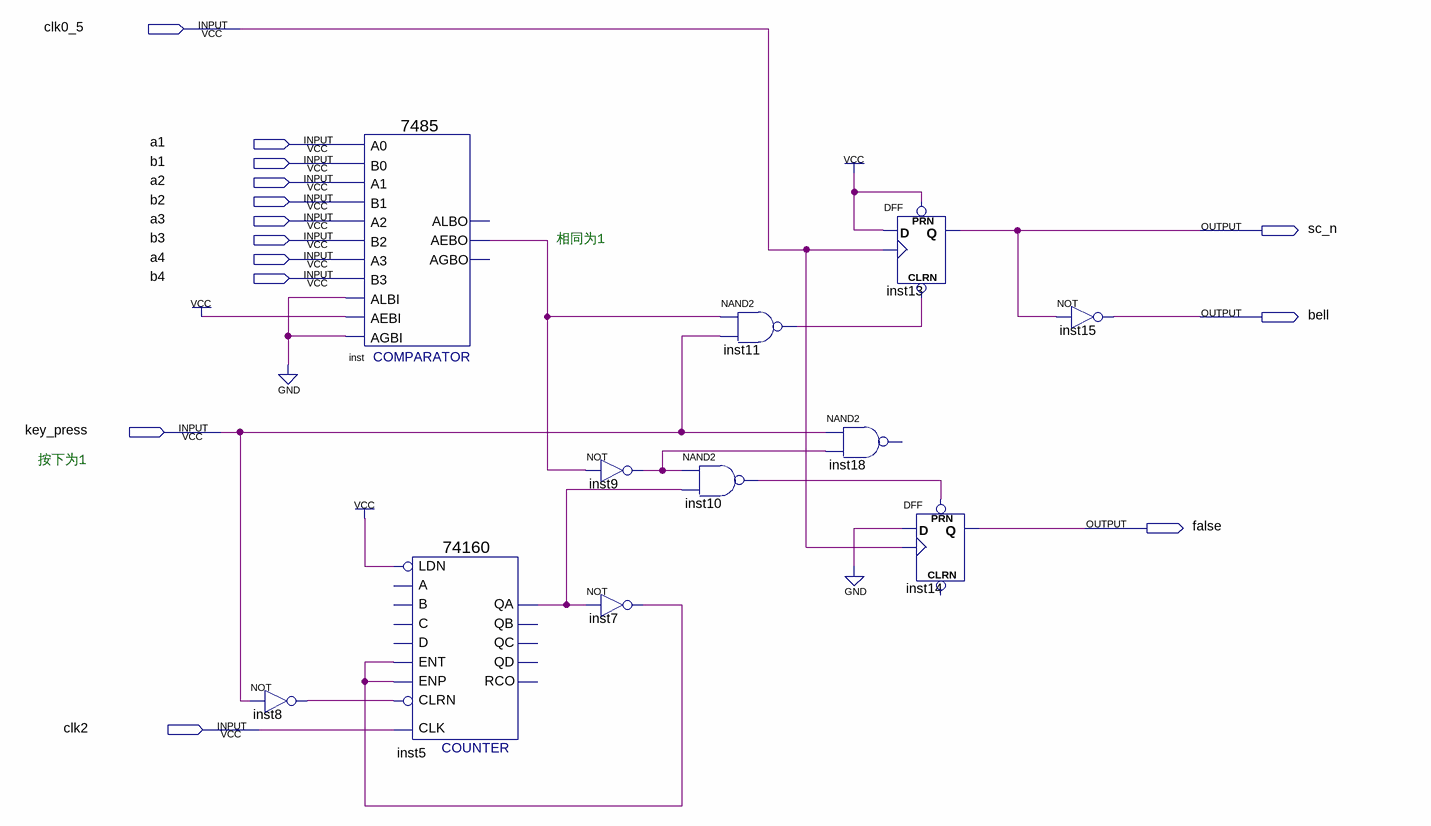
[diagram p0: schematic sheet]
// Quartus schematic compare.bdf as structural Verilog: 11 symbols, 14 pins
module compare (
  input  clk0_5,
  input  a1,
  input  b1,
  input  a2,
  input  b2,
  input  a3,
  input  b3,
  input  a4,
  input  b4,
  input  key_press,
  input  clk2,
  output sc_n,
  output bell,
  output false
);

  wire inst5_qa, inst7_out, inst8_out, inst9_out, inst10_out, inst11_out, inst_aebo;

  not inst8 (inst8_out, key_press);
  \7485  inst (
    .A3(a4), .B2(b3), .A2(a3), .AEBI(1'b1), .AGBI(1'b0), .ALBI(1'b0), .A0(a1), .B0(b1), .B3(b4), .A1(a2),
    .B1(b2), .AEBO(inst_aebo));  // open: ALBO, AGBO
  \74160  inst5 (
    .CLK(clk2), .ENT(inst7_out), .LDN(1'b1), .ENP(inst7_out), .CLRN(inst8_out), .QA(inst5_qa));  // open: A, B, C, D, QD, QB, QC, RCO
  not inst9 (inst9_out, inst_aebo);
  not inst7 (inst7_out, inst5_qa);
  nand inst10 (inst10_out, inst9_out, inst5_qa);
  nand inst11 (inst11_out, inst_aebo, key_press);
  // NAND2 inst18 has open pins: IN1=key_press, IN2=inst9_out, OUT=open
  DFF inst13 (.CLRN(inst11_out), .CLK(clk0_5), .D(1'b1), .PRN(1'b1), .Q(sc_n));
  DFF inst14 (.CLK(clk0_5), .D(1'b0), .PRN(inst10_out), .Q(false));  // open: CLRN
  not inst15 (bell, sc_n);

  // Notes on the sheet:
  //   相同为1
  //   按下为1
endmodule
